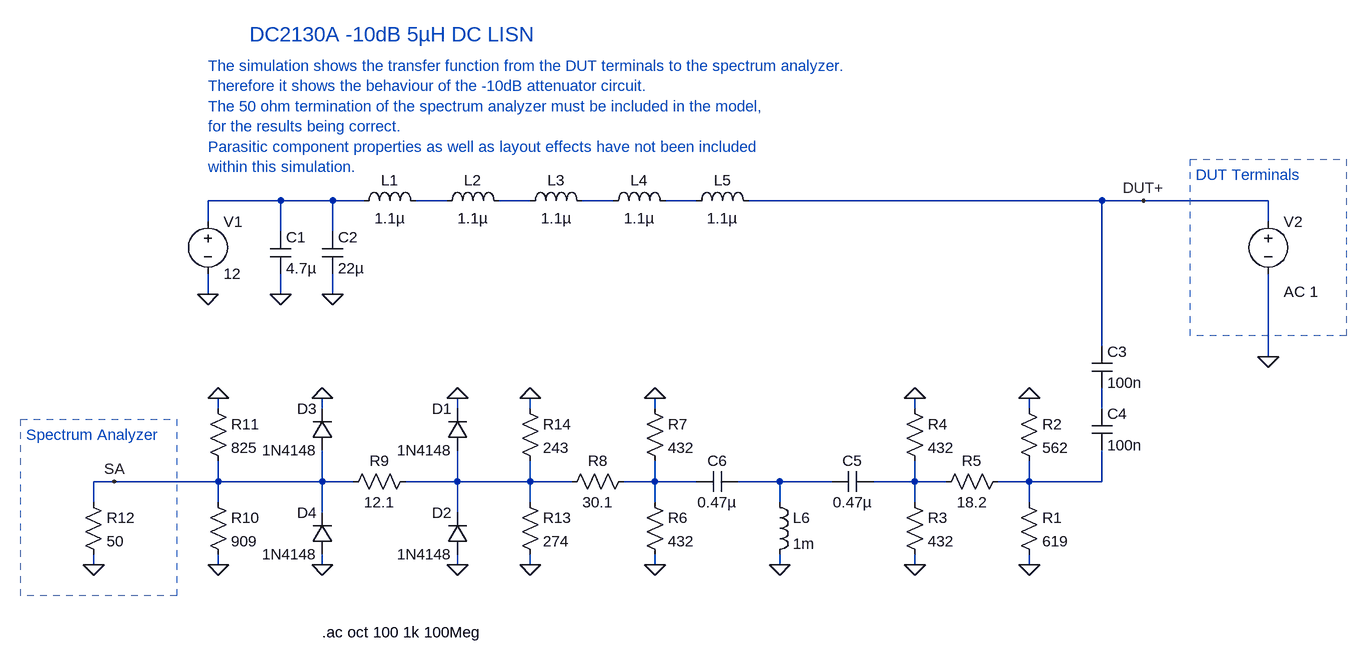
[diagram p0: schematic DC2130A_LISN_TransferFunction.asc]
DC2130A_LISN_TransferFunction.asc, the LTspice schematic file:
Version 4
SHEET 1 2328 2660
WIRE 64 -80 -48 -80
WIRE 144 -80 64 -80
WIRE 192 -80 144 -80
WIRE 320 -80 272 -80
WIRE 448 -80 400 -80
WIRE 576 -80 528 -80
WIRE 704 -80 656 -80
WIRE 1328 -80 784 -80
WIRE 1392 -80 1328 -80
WIRE 1584 -80 1392 -80
WIRE -48 -48 -48 -80
WIRE 1584 -48 1584 -80
WIRE 64 -32 64 -80
WIRE 144 -32 144 -80
WIRE -48 64 -48 32
WIRE 64 64 64 32
WIRE 144 64 144 32
WIRE 1328 144 1328 -80
WIRE 1584 160 1584 32
WIRE -32 240 -32 224
WIRE 128 240 128 224
WIRE 336 240 336 224
WIRE 448 240 448 224
WIRE 640 240 640 224
WIRE 1040 240 1040 224
WIRE 1216 240 1216 224
WIRE 1328 240 1328 208
WIRE -192 352 -224 352
WIRE -32 352 -32 320
WIRE -32 352 -192 352
WIRE 128 352 128 304
WIRE 128 352 -32 352
WIRE 176 352 128 352
WIRE 336 352 336 304
WIRE 336 352 256 352
WIRE 448 352 448 320
WIRE 448 352 336 352
WIRE 512 352 448 352
WIRE 640 352 640 320
WIRE 640 352 592 352
WIRE 704 352 640 352
WIRE 832 352 768 352
WIRE 912 352 832 352
WIRE 1040 352 1040 320
WIRE 1040 352 976 352
WIRE 1088 352 1040 352
WIRE 1216 352 1216 320
WIRE 1216 352 1168 352
WIRE 1328 352 1328 304
WIRE 1328 352 1216 352
WIRE -224 384 -224 352
WIRE -32 384 -32 352
WIRE 448 384 448 352
WIRE 640 384 640 352
WIRE 832 384 832 352
WIRE 1040 384 1040 352
WIRE 1216 384 1216 352
WIRE 128 400 128 352
WIRE 336 400 336 352
WIRE -224 480 -224 464
WIRE -32 480 -32 464
WIRE 128 480 128 464
WIRE 336 480 336 464
WIRE 448 480 448 464
WIRE 640 480 640 464
WIRE 832 480 832 464
WIRE 1040 480 1040 464
WIRE 1216 480 1216 464
FLAG 64 64 0
FLAG 144 64 0
FLAG 1216 480 0
FLAG 1040 480 0
FLAG 1040 224 0
FLAG 1216 224 0
FLAG 640 480 0
FLAG 640 224 0
FLAG -32 480 0
FLAG -32 224 0
FLAG -48 64 0
FLAG 1584 160 0
FLAG 336 224 0
FLAG 128 224 0
FLAG 336 480 0
FLAG 128 480 0
FLAG 832 480 0
FLAG -224 480 0
FLAG 448 480 0
FLAG 448 224 0
FLAG -192 352 SA
FLAG 1392 -80 DUT+
SYMBOL voltage -48 -64 R0
WINDOW 123 24 124 Left 2
WINDOW 39 0 0 Left 2
SYMATTR InstName V1
SYMATTR Value 12
SYMBOL ind 176 -64 R270
WINDOW 0 32 56 VTop 2
WINDOW 3 5 56 VBottom 2
SYMATTR InstName L1
SYMATTR Value 1.1µ
SYMBOL ind 304 -64 R270
WINDOW 0 32 56 VTop 2
WINDOW 3 5 56 VBottom 2
SYMATTR InstName L2
SYMATTR Value 1.1µ
SYMBOL ind 432 -64 R270
WINDOW 0 32 56 VTop 2
WINDOW 3 5 56 VBottom 2
SYMATTR InstName L3
SYMATTR Value 1.1µ
SYMBOL ind 560 -64 R270
WINDOW 0 32 56 VTop 2
WINDOW 3 5 56 VBottom 2
SYMATTR InstName L4
SYMATTR Value 1.1µ
SYMBOL ind 688 -64 R270
WINDOW 0 32 56 VTop 2
WINDOW 3 5 56 VBottom 2
SYMATTR InstName L5
SYMATTR Value 1.1µ
SYMBOL cap 48 -32 R0
SYMATTR InstName C1
SYMATTR Value 4.7µ
SYMBOL cap 128 -32 R0
SYMATTR InstName C2
SYMATTR Value 22µ
SYMBOL cap 1312 144 R0
SYMATTR InstName C3
SYMATTR Value 100n
SYMBOL cap 1312 240 R0
SYMATTR InstName C4
SYMATTR Value 100n
SYMBOL res 1200 368 R0
SYMATTR InstName R1
SYMATTR Value 619
SYMBOL res 1200 224 R0
SYMATTR InstName R2
SYMATTR Value 562
SYMBOL res 1024 368 R0
SYMATTR InstName R3
SYMATTR Value 432
SYMBOL res 1024 224 R0
SYMATTR InstName R4
SYMATTR Value 432
SYMBOL res 1184 336 R90
WINDOW 0 0 56 VBottom 2
WINDOW 3 32 56 VTop 2
SYMATTR InstName R5
SYMATTR Value 18.2
SYMBOL cap 976 336 R90
WINDOW 0 0 32 VBottom 2
WINDOW 3 32 32 VTop 2
SYMATTR InstName C5
SYMATTR Value 0.47µ
SYMBOL ind 816 368 R0
SYMATTR InstName L6
SYMATTR Value 1m
SYMBOL cap 768 336 R90
WINDOW 0 0 32 VBottom 2
WINDOW 3 32 32 VTop 2
SYMATTR InstName C6
SYMATTR Value 0.47µ
SYMBOL res 624 368 R0
SYMATTR InstName R6
SYMATTR Value 432
SYMBOL res 624 224 R0
SYMATTR InstName R7
SYMATTR Value 432
SYMBOL res 608 336 R90
WINDOW 0 0 56 VBottom 2
WINDOW 3 32 56 VTop 2
SYMATTR InstName R8
SYMATTR Value 30.1
SYMBOL diode 352 304 R180
WINDOW 0 24 64 Left 2
WINDOW 3 24 0 Left 2
SYMATTR InstName D1
SYMATTR Value 1N4148
SYMBOL diode 352 464 R180
WINDOW 0 24 64 Left 2
WINDOW 3 24 0 Left 2
SYMATTR InstName D2
SYMATTR Value 1N4148
SYMBOL res 272 336 R90
WINDOW 0 0 56 VBottom 2
WINDOW 3 32 56 VTop 2
SYMATTR InstName R9
SYMATTR Value 12.1
SYMBOL diode 144 304 R180
WINDOW 0 24 64 Left 2
WINDOW 3 24 0 Left 2
SYMATTR InstName D3
SYMATTR Value 1N4148
SYMBOL diode 144 464 R180
WINDOW 0 24 64 Left 2
WINDOW 3 24 0 Left 2
SYMATTR InstName D4
SYMATTR Value 1N4148
SYMBOL res -48 368 R0
SYMATTR InstName R10
SYMATTR Value 909
SYMBOL res -48 224 R0
SYMATTR InstName R11
SYMATTR Value 825
SYMBOL res -240 368 R0
SYMATTR InstName R12
SYMATTR Value 50
SYMBOL res 432 368 R0
SYMATTR InstName R13
SYMATTR Value 274
SYMBOL res 432 224 R0
SYMATTR InstName R14
SYMATTR Value 243
SYMBOL voltage 1584 -64 R0
WINDOW 123 24 124 Left 2
WINDOW 39 0 0 Left 2
SYMATTR Value2 AC 1
SYMATTR InstName V2
SYMATTR Value ""
TEXT 128 584 Left 2 !.ac oct 100 1k 100Meg
TEXT 16 -336 Left 3 ;DC2130A -10dB 5µH DC LISN
TEXT -328 280 Left 2 ;Spectrum Analyzer
TEXT -48 -288 Left 2 ;The simulation shows the transfer function from the DUT terminals to the spectrum analyzer.\nTherefore it shows the behaviour of the -10dB attenuator circuit.\nThe 50 ohm termination of the spectrum analyzer must be included in the model,\nfor the results being correct.\nParasitic component properties as well as layout effects have not been included\nwithin this simulation.
TEXT 1472 -120 Left 2 ;DUT Terminals
RECTANGLE Normal -96 528 -336 256 2
RECTANGLE Normal 1704 128 1464 -144 2

The netlist it stands for:
* DC2130A_LISN_TransferFunction.asc
V1 N001 0 12
L1 N001 N002 1.1µ
L2 N002 N003 1.1µ
L3 N003 N004 1.1µ
L4 N004 N005 1.1µ
L5 N005 DUT+ 1.1µ
C1 N001 0 4.7µ
C2 N001 0 22µ
C3 DUT+ N006 100n
C4 N006 N011 100n
R1 N011 0 619
R2 0 N011 562
R3 N010 0 432
R4 0 N010 432
R5 N011 N010 18.2
C5 N010 N009 0.47µ
L6 N009 0 1m
C6 N009 N008 0.47µ
R6 N008 0 432
R7 0 N008 432
R8 N008 N007 30.1
D1 N007 0 1N4148
D2 0 N007 1N4148
R9 N007 SA 12.1
D3 SA 0 1N4148
D4 0 SA 1N4148
R10 SA 0 909
R11 0 SA 825
R12 SA 0 50
R13 N007 0 274
R14 0 N007 243
V2 DUT+ 0 AC 1
.model D D
.lib standard.dio
.ac oct 100 1k 100Meg
* DC2130A -10dB 5µH DC LISN
* Spectrum Analyzer
* The simulation shows the transfer function from the DUT terminals to the spectrum analyzer.
* Therefore it shows the behaviour of the -10dB attenuator circuit.
* The 50 ohm termination of the spectrum analyzer must be included in the model,
* for the results being correct.
* Parasitic component properties as well as layout effects have not been included
* within this simulation.
* DUT Terminals
.backanno
.end